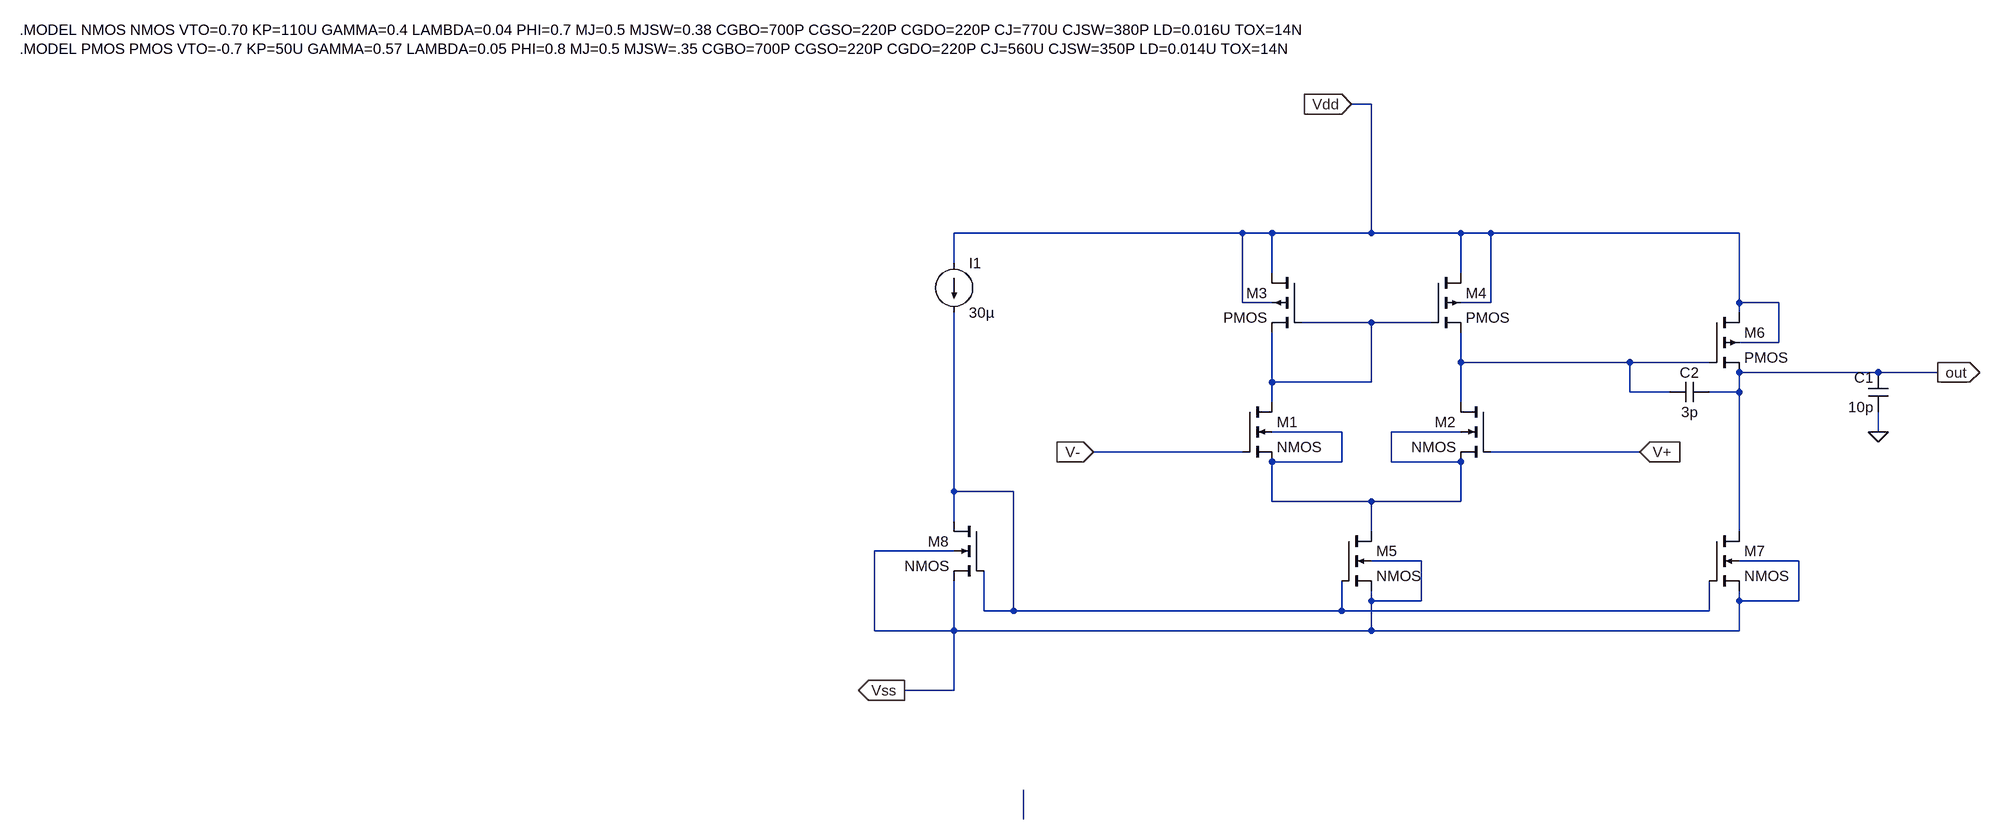
[diagram p0: schematic OPAMP.asc]
OPAMP.asc, the LTspice schematic file:
Version 4
SHEET 1 1216 708
WIRE 208 -464 176 -464
WIRE 0 -256 -464 -256
WIRE 48 -256 0 -256
WIRE 208 -256 208 -464
WIRE 208 -256 48 -256
WIRE 352 -256 208 -256
WIRE 400 -256 352 -256
WIRE 800 -256 400 -256
WIRE -464 -208 -464 -256
WIRE 48 -192 48 -256
WIRE 352 -192 352 -256
WIRE 0 -144 0 -256
WIRE 48 -144 0 -144
WIRE 400 -144 400 -256
WIRE 400 -144 352 -144
WIRE 800 -144 800 -256
WIRE 864 -144 800 -144
WIRE 800 -128 800 -144
WIRE 208 -112 96 -112
WIRE 304 -112 208 -112
WIRE 864 -80 864 -144
WIRE 864 -80 800 -80
WIRE 352 -48 352 -96
WIRE 624 -48 352 -48
WIRE 752 -48 624 -48
WIRE 1024 -32 800 -32
WIRE 1120 -32 1024 -32
WIRE 48 -16 48 -96
WIRE 208 -16 208 -112
WIRE 208 -16 48 -16
WIRE 624 0 624 -48
WIRE 688 0 624 0
WIRE 800 0 800 -32
WIRE 800 0 752 0
WIRE 48 16 48 -16
WIRE 352 16 352 -48
WIRE 160 64 48 64
WIRE 352 64 240 64
WIRE 1024 64 1024 32
WIRE 0 96 -240 96
WIRE 640 96 400 96
WIRE 160 112 160 64
WIRE 160 112 48 112
WIRE 240 112 240 64
WIRE 352 112 240 112
WIRE -464 160 -464 -128
WIRE -368 160 -464 160
WIRE 48 176 48 112
WIRE 208 176 48 176
WIRE 352 176 352 112
WIRE 352 176 208 176
WIRE -464 208 -464 160
WIRE 208 224 208 176
WIRE 800 224 800 0
WIRE -464 256 -592 256
WIRE 288 272 208 272
WIRE 896 272 800 272
WIRE 208 336 208 320
WIRE 288 336 288 272
WIRE 288 336 208 336
WIRE 800 336 800 320
WIRE 896 336 896 272
WIRE 896 336 800 336
WIRE -416 352 -416 288
WIRE -368 352 -368 160
WIRE -368 352 -416 352
WIRE 160 352 160 304
WIRE 160 352 -368 352
WIRE 752 352 752 304
WIRE 752 352 160 352
WIRE -592 384 -592 256
WIRE -464 384 -464 304
WIRE -464 384 -592 384
WIRE 208 384 208 336
WIRE 208 384 -464 384
WIRE 800 384 800 336
WIRE 800 384 208 384
WIRE -464 480 -464 384
WIRE -464 480 -544 480
WIRE -352 688 -352 640
FLAG 1024 64 0
FLAG 1120 -32 out
IOPIN 1120 -32 Out
FLAG 176 -464 Vdd
IOPIN 176 -464 In
FLAG -240 96 V-
IOPIN -240 96 In
FLAG 640 96 V+
IOPIN 640 96 In
FLAG -544 480 Vss
IOPIN -544 480 Out
SYMBOL nmos4 0 16 R0
SYMATTR InstName M1
SYMATTR Value2 l=100n w=300n
SYMBOL nmos4 400 16 M0
SYMATTR InstName M2
SYMATTR Value2 l=100n w=300n
SYMBOL pmos4 96 -192 M0
SYMATTR InstName M3
SYMATTR Value2 l=100n w=1100n
SYMBOL pmos4 304 -192 R0
SYMATTR InstName M4
SYMATTR Value2 l=100n w=1100n
SYMBOL nmos4 160 224 R0
SYMATTR InstName M5
SYMATTR Value2 l=100n w=200n
SYMBOL cap 1040 32 R180
WINDOW 0 24 56 Left 2
WINDOW 3 24 8 Left 2
SYMATTR InstName C1
SYMATTR Value 10p
SYMBOL current -464 -208 R0
WINDOW 123 0 0 Left 0
WINDOW 39 0 0 Left 0
SYMATTR InstName I1
SYMATTR Value 30µ
SYMBOL nmos4 -416 208 M0
SYMATTR InstName M8
SYMATTR Value2 l=100n w=200n
SYMBOL nmos4 752 224 R0
SYMATTR InstName M7
SYMATTR Value2 l=100n w=810n
SYMBOL pmos4 752 -128 R0
SYMATTR InstName M6
SYMATTR Value2 l=100n w=9000n
SYMBOL cap 752 -16 R90
WINDOW 0 0 32 VBottom 2
WINDOW 3 32 32 VTop 2
SYMATTR InstName C2
SYMATTR Value 3p
TEXT -1968 -584 Left 2 !.MODEL NMOS NMOS VTO=0.70 KP=110U GAMMA=0.4 LAMBDA=0.04 PHI=0.7 MJ=0.5 MJSW=0.38 CGBO=700P CGSO=220P CGDO=220P CJ=770U CJSW=380P LD=0.016U TOX=14N\n.MODEL PMOS PMOS VTO=-0.7 KP=50U GAMMA=0.57 LAMBDA=0.05 PHI=0.8 MJ=0.5 MJSW=.35 CGBO=700P CGSO=220P CGDO=220P CJ=560U CJSW=350P LD=0.014U TOX=14N

The netlist it stands for:
* OPAMP.asc
M1 N001 V- N003 N003 NMOS l=100n w=300n
M2 N002 V+ N003 N003 NMOS l=100n w=300n
M3 Vdd N001 N001 Vdd PMOS l=100n w=1100n
M4 Vdd N001 N002 Vdd PMOS l=100n w=1100n
M5 N003 N004 Vss Vss NMOS l=100n w=200n
C1 0 out 10p
I1 Vdd N004 30µ
M8 N004 N004 Vss Vss NMOS l=100n w=200n
M7 out N004 Vss Vss NMOS l=100n w=810n
M6 Vdd N002 out Vdd PMOS l=100n w=9000n
C2 out N002 3p
.model NMOS NMOS
.model PMOS PMOS
.lib standard.mos
.MODEL NMOS NMOS VTO=0.70 KP=110U GAMMA=0.4 LAMBDA=0.04 PHI=0.7 MJ=0.5 MJSW=0.38 CGBO=700P CGSO=220P CGDO=220P CJ=770U CJSW=380P LD=0.016U TOX=14N
.MODEL PMOS PMOS VTO=-0.7 KP=50U GAMMA=0.57 LAMBDA=0.05 PHI=0.8 MJ=0.5 MJSW=.35 CGBO=700P CGSO=220P CGDO=220P CJ=560U CJSW=350P LD=0.014U TOX=14N
.backanno
.end